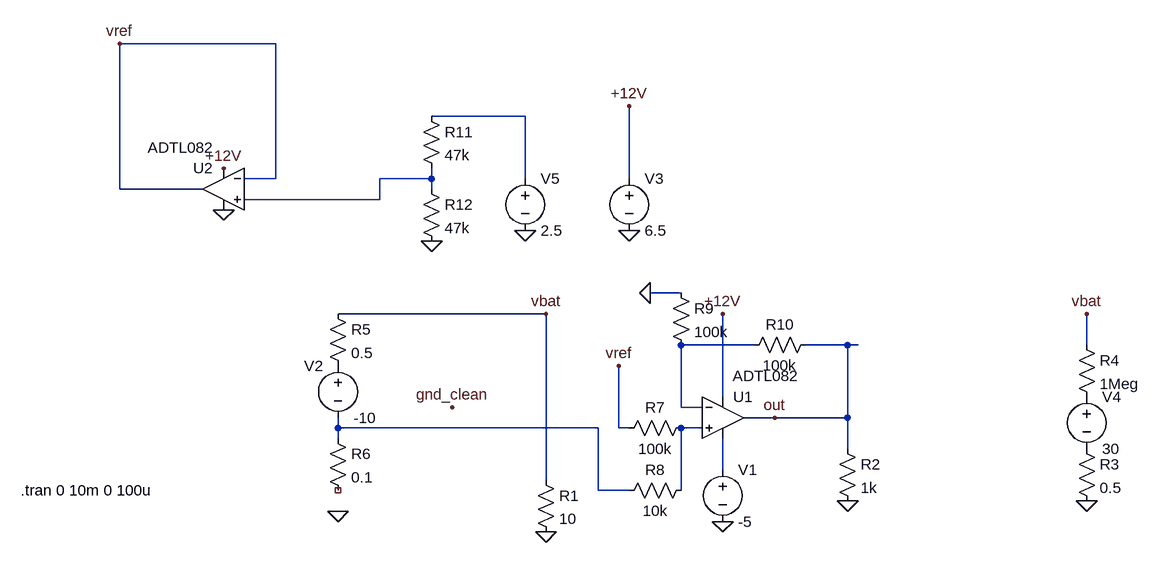
[diagram p0: schematic gnd_diff_opamp_tl082.asc]
gnd_diff_opamp_tl082.asc, the LTspice schematic file:
Version 4
SHEET 1 904 680
WIRE -432 -416 -672 -416
WIRE -48 -304 -192 -304
WIRE -432 -208 -432 -416
WIRE -432 -208 -480 -208
WIRE -192 -208 -192 -224
WIRE -192 -208 -272 -208
WIRE -48 -208 -48 -304
WIRE 112 -208 112 -320
WIRE -672 -192 -672 -416
WIRE -544 -192 -672 -192
WIRE -192 -192 -192 -208
WIRE -272 -176 -272 -208
WIRE -272 -176 -480 -176
WIRE 192 -32 144 -32
WIRE -16 0 -336 0
WIRE 304 48 192 48
WIRE 448 48 384 48
WIRE 464 48 448 48
WIRE 816 48 816 0
WIRE 256 128 256 0
WIRE 192 144 192 48
WIRE 224 144 192 144
WIRE 336 160 288 160
WIRE 448 160 448 48
WIRE 448 160 336 160
WIRE -336 176 -336 160
WIRE 64 176 -336 176
WIRE 96 176 96 80
WIRE 112 176 96 176
WIRE 224 176 192 176
WIRE -336 192 -336 176
WIRE 448 208 448 160
WIRE 256 240 256 192
WIRE -16 256 -16 0
WIRE 64 272 64 176
WIRE 112 272 64 272
WIRE 192 272 192 176
FLAG -336 304 0
FLAG 256 320 0
FLAG 448 288 0
FLAG 112 -128 0
FLAG 336 160 out
FLAG -160 144 gnd_clean
FLAG -48 -128 0
FLAG 816 288 0
FLAG 112 -320 +12V
FLAG 256 0 +12V
FLAG -16 336 0
FLAG -16 0 vbat
FLAG 816 0 vbat
FLAG 96 80 vref
FLAG 144 -32 0
FLAG -192 -112 0
FLAG -512 -224 +12V
FLAG -512 -160 0
FLAG -672 -416 vref
SYMBOL OpAmps\\ADTL082 256 96 R0
WINDOW 3 15 0 Left 2
SYMATTR InstName U1
SYMBOL voltage -336 64 R0
WINDOW 123 0 0 Left 0
WINDOW 39 0 0 Left 0
WINDOW 0 -52 16 Left 2
SYMATTR InstName V2
SYMATTR Value -10
SYMBOL res -352 176 R0
SYMATTR InstName R6
SYMATTR Value 0.1
SYMBOL res -32 240 R0
SYMATTR InstName R1
SYMATTR Value 10
SYMBOL res 432 192 R0
SYMATTR InstName R2
SYMATTR Value 1k
SYMBOL voltage 112 -224 R0
WINDOW 123 0 0 Left 0
WINDOW 39 0 0 Left 0
SYMATTR InstName V3
SYMATTR Value 6.5
SYMBOL voltage 816 112 R0
WINDOW 123 0 0 Left 0
WINDOW 39 0 0 Left 0
SYMATTR InstName V4
SYMATTR Value 30
SYMBOL voltage -48 -224 R0
WINDOW 123 0 0 Left 0
WINDOW 39 0 0 Left 0
SYMATTR InstName V5
SYMATTR Value 2.5
SYMBOL res 800 192 R0
SYMATTR InstName R3
SYMATTR Value 0.5
SYMBOL res 800 32 R0
SYMATTR InstName R4
SYMATTR Value 1Meg
SYMBOL res -352 -16 R0
SYMATTR InstName R5
SYMATTR Value 0.5
SYMBOL res 208 160 R90
WINDOW 0 0 56 VBottom 2
WINDOW 3 32 56 VTop 2
SYMATTR InstName R7
SYMATTR Value 100k
SYMBOL res 208 256 R90
WINDOW 0 0 56 VBottom 2
WINDOW 3 32 56 VTop 2
SYMATTR InstName R8
SYMATTR Value 10k
SYMBOL res 176 -48 R0
SYMATTR InstName R9
SYMATTR Value 100k
SYMBOL res 400 32 R90
WINDOW 0 0 56 VBottom 2
WINDOW 3 32 56 VTop 2
SYMATTR InstName R10
SYMATTR Value 100k
SYMBOL res -208 -320 R0
SYMATTR InstName R11
SYMATTR Value 47k
SYMBOL res -208 -208 R0
SYMATTR InstName R12
SYMATTR Value 47k
SYMBOL OpAmps\\ADTL082 -512 -256 M0
WINDOW 3 15 0 Left 2
SYMATTR InstName U2
SYMBOL voltage 256 224 R0
WINDOW 123 0 0 Left 0
WINDOW 39 0 0 Left 0
SYMATTR InstName V1
SYMATTR Value -5
TEXT -824 272 Left 2 !.tran 0 10m 0 100u

The netlist it stands for:
* gnd_diff_opamp_tl082.asc
XU1 N005 N003 +12V N006 out ADTL082  ; pins In+ In- V+ V- OUT
V2 P001 N004 -10
R6 N004 NC_01 0.1
R1 vbat 0 10
R2 out 0 1k
V3 +12V 0 6.5
V4 P002 P003 30
V5 N001 0 2.5
R3 P003 0 0.5
R4 vbat P002 1Meg
R5 vbat P001 0.5
R7 N005 vref 100k
R8 N005 N004 10k
R9 0 N003 100k
R10 out N003 100k
R11 N001 N002 47k
R12 N002 0 47k
XU2 N002 vref +12V 0 vref ADTL082  ; pins In+ In- V+ V- OUT
V1 N006 0 -5
.tran 0 10m 0 100u
.lib ADI.lib
.backanno
.end